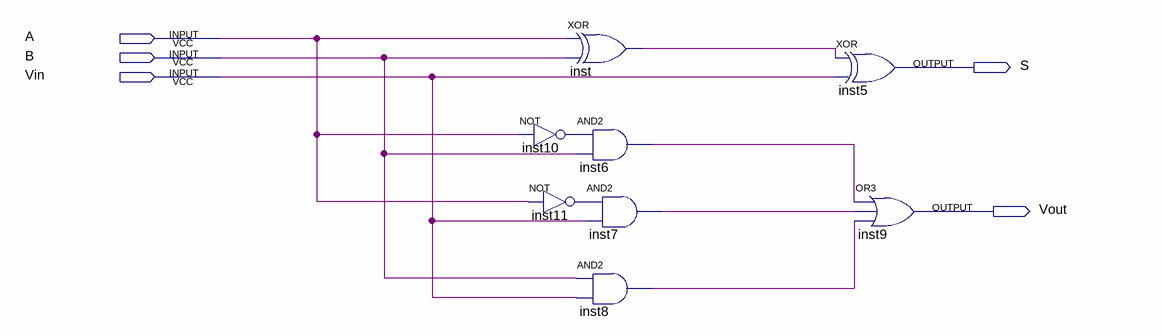
[diagram p0: schematic sheet]
// Quartus schematic Aula07.bdf as structural Verilog: 8 symbols, 5 pins
module Aula07 (
  input  A,
  input  B,
  input  Vin,
  output S,
  output Vout
);

  wire inst6_out, inst7_out, inst8_out, inst10_out, inst11_out, inst_out;

  not inst10 (inst10_out, A);
  xor inst (inst_out, A, B);
  and inst6 (inst6_out, inst10_out, B);
  and inst7 (inst7_out, inst11_out, Vin);
  not inst11 (inst11_out, A);
  and inst8 (inst8_out, B, Vin);
  xor inst5 (S, inst_out, Vin);
  or inst9 (Vout, inst6_out, inst7_out, inst8_out);
endmodule
